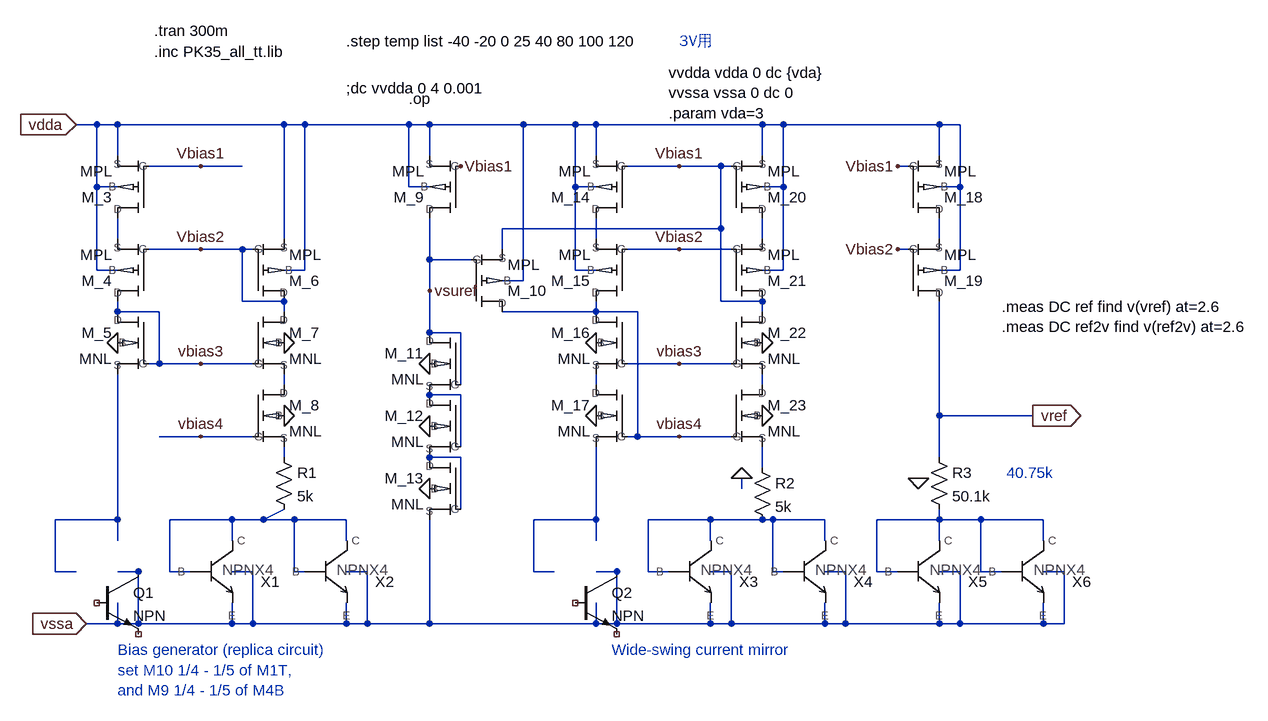
[diagram p0: schematic bgr.asc]
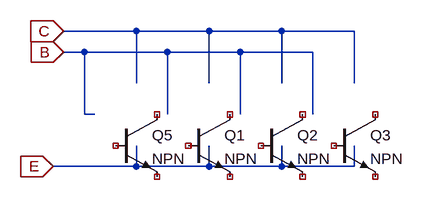
[diagram p1: sub-circuit npn4.asc]
bgr.asc, the LTspice schematic file:
Version 4
SHEET 1 4860 5172
WIRE 800 -592 768 -592
WIRE 832 -592 800 -592
WIRE 1088 -592 832 -592
WIRE 1120 -592 1088 -592
WIRE 1280 -592 1120 -592
WIRE 1312 -592 1280 -592
WIRE 1456 -592 1312 -592
WIRE 1536 -592 1456 -592
WIRE 1568 -592 1536 -592
WIRE 1824 -592 1568 -592
WIRE 1856 -592 1824 -592
WIRE 2096 -592 1856 -592
WIRE 2128 -592 2096 -592
WIRE 832 -544 832 -592
WIRE 1312 -544 1312 -592
WIRE 1568 -544 1568 -592
WIRE 1824 -544 1824 -592
WIRE 2096 -544 2096 -592
WIRE 960 -528 880 -528
WIRE 1024 -528 960 -528
WIRE 1696 -528 1616 -528
WIRE 1760 -528 1696 -528
WIRE 1776 -528 1760 -528
WIRE 2048 -528 2032 -528
WIRE 800 -496 800 -592
WIRE 832 -496 800 -496
WIRE 1280 -496 1280 -592
WIRE 1312 -496 1280 -496
WIRE 1536 -496 1536 -592
WIRE 1568 -496 1536 -496
WIRE 1856 -496 1856 -592
WIRE 1856 -496 1824 -496
WIRE 2128 -496 2128 -592
WIRE 2128 -496 2096 -496
WIRE 1760 -432 1760 -528
WIRE 1760 -432 1424 -432
WIRE 832 -416 832 -448
WIRE 1088 -416 1088 -592
WIRE 1568 -416 1568 -448
WIRE 1824 -416 1824 -448
WIRE 2096 -416 2096 -448
WIRE 960 -400 880 -400
WIRE 1024 -400 960 -400
WIRE 1040 -400 1024 -400
WIRE 1424 -400 1424 -432
WIRE 1696 -400 1616 -400
WIRE 1776 -400 1696 -400
WIRE 2048 -400 2032 -400
WIRE 1312 -384 1312 -448
WIRE 1376 -384 1312 -384
WIRE 800 -368 800 -496
WIRE 832 -368 800 -368
WIRE 1120 -368 1120 -592
WIRE 1120 -368 1088 -368
WIRE 1536 -368 1536 -496
WIRE 1568 -368 1536 -368
WIRE 1856 -368 1856 -496
WIRE 1856 -368 1824 -368
WIRE 2128 -368 2128 -496
WIRE 2128 -368 2096 -368
WIRE 1456 -352 1456 -592
WIRE 1456 -352 1424 -352
WIRE 1312 -336 1312 -384
WIRE 1024 -320 1024 -400
WIRE 1088 -320 1024 -320
WIRE 1760 -320 1760 -432
WIRE 1824 -320 1824 -336
WIRE 1824 -320 1760 -320
WIRE 832 -304 832 -320
WIRE 896 -304 832 -304
WIRE 1088 -304 1088 -320
WIRE 1568 -304 1568 -320
WIRE 1568 -304 1424 -304
WIRE 1632 -304 1568 -304
WIRE 1824 -304 1824 -320
WIRE 1312 -272 1312 -336
WIRE 1360 -272 1312 -272
WIRE 896 -224 896 -304
WIRE 896 -224 880 -224
WIRE 960 -224 896 -224
WIRE 1040 -224 960 -224
WIRE 1696 -224 1616 -224
WIRE 1776 -224 1696 -224
WIRE 1088 -192 1088 -208
WIRE 1360 -192 1360 -272
WIRE 1568 -192 1568 -208
WIRE 1824 -192 1824 -208
WIRE 1360 -176 1312 -176
WIRE 2096 -144 2096 -320
WIRE 2240 -144 2096 -144
WIRE 960 -112 896 -112
WIRE 1040 -112 960 -112
WIRE 1632 -112 1632 -304
WIRE 1632 -112 1616 -112
WIRE 1696 -112 1632 -112
WIRE 1776 -112 1696 -112
WIRE 1360 -96 1360 -176
WIRE 1088 -80 1088 -96
WIRE 1360 -80 1312 -80
WIRE 2096 -80 2096 -144
WIRE 1824 -64 1824 -96
WIRE 1792 -32 1792 -48
WIRE 1360 0 1360 -80
WIRE 832 16 832 -208
WIRE 832 16 736 16
WIRE 1008 16 912 16
WIRE 1056 16 1088 0
WIRE 1056 16 1008 16
WIRE 1104 16 1056 16
WIRE 1184 16 1104 16
WIRE 1568 16 1568 -96
WIRE 1568 16 1472 16
WIRE 1744 16 1648 16
WIRE 1824 16 1744 16
WIRE 1840 16 1824 16
WIRE 1920 16 1840 16
WIRE 2096 16 2096 0
WIRE 2096 16 2000 16
WIRE 2160 16 2096 16
WIRE 2256 16 2160 16
WIRE 832 48 832 16
WIRE 1008 48 1008 16
WIRE 1184 48 1184 16
WIRE 1568 48 1568 16
WIRE 1744 48 1744 16
WIRE 1920 48 1920 16
WIRE 2096 48 2096 16
WIRE 2256 48 2256 16
WIRE 736 96 736 16
WIRE 768 96 736 96
WIRE 864 96 832 96
WIRE 912 96 912 16
WIRE 944 96 912 96
WIRE 1040 96 1008 96
WIRE 1104 96 1104 16
WIRE 1120 96 1104 96
WIRE 1216 96 1184 96
WIRE 1472 96 1472 16
WIRE 1504 96 1472 96
WIRE 1600 96 1568 96
WIRE 1648 96 1648 16
WIRE 1680 96 1648 96
WIRE 1776 96 1744 96
WIRE 1840 96 1840 16
WIRE 1856 96 1840 96
WIRE 1952 96 1920 96
WIRE 2000 96 2000 16
WIRE 2032 96 2000 96
WIRE 2128 96 2096 96
WIRE 2160 96 2160 16
WIRE 2192 96 2160 96
WIRE 2288 96 2256 96
WIRE 832 176 832 144
WIRE 832 176 784 176
WIRE 864 176 864 96
WIRE 864 176 832 176
WIRE 1008 176 1008 144
WIRE 1008 176 864 176
WIRE 1040 176 1040 96
WIRE 1040 176 1008 176
WIRE 1184 176 1184 144
WIRE 1184 176 1040 176
WIRE 1216 176 1216 96
WIRE 1216 176 1184 176
WIRE 1312 176 1312 16
WIRE 1312 176 1216 176
WIRE 1568 176 1568 144
WIRE 1568 176 1312 176
WIRE 1600 176 1600 96
WIRE 1600 176 1568 176
WIRE 1744 176 1744 144
WIRE 1744 176 1600 176
WIRE 1776 176 1776 96
WIRE 1776 176 1744 176
WIRE 1920 176 1920 144
WIRE 1920 176 1776 176
WIRE 1952 176 1952 96
WIRE 1952 176 1920 176
WIRE 2096 176 2096 144
WIRE 2096 176 1952 176
WIRE 2128 176 2128 96
WIRE 2128 176 2096 176
WIRE 2256 176 2256 144
WIRE 2256 176 2128 176
WIRE 2288 176 2288 96
WIRE 2288 176 2256 176
FLAG 1312 -336 vsuref
FLAG 1696 -528 Vbias1
FLAG 1360 -528 Vbias1
FLAG 1696 -400 Vbias2
FLAG 2032 -528 Vbias1
FLAG 2032 -400 Vbias2
FLAG 768 -592 vdda
IOPIN 768 -592 In
FLAG 784 176 vssa
IOPIN 784 176 In
FLAG 2240 -144 vref
IOPIN 2240 -144 Out
FLAG 960 -528 Vbias1
FLAG 960 -400 Vbias2
FLAG 1696 -224 vbias3
FLAG 1696 -112 vbias4
FLAG 960 -112 vbias4
FLAG 960 -224 vbias3
FLAG 1792 -48 0
FLAG 2064 -48 0
FLAG 832 -256 0
FLAG 1088 -256 0
FLAG 1088 -144 0
FLAG 1312 -224 0
FLAG 1312 -128 0
FLAG 1312 -32 0
FLAG 1568 -256 0
FLAG 1568 -144 0
FLAG 1824 -256 0
FLAG 1824 -144 0
SYMBOL NPN4 976 96 R0
SYMATTR InstName X1
SYMBOL NPN4 1152 96 R0
SYMATTR InstName X2
SYMBOL NPN4 1712 96 R0
SYMATTR InstName X3
SYMBOL NPN4 1888 96 R0
SYMATTR InstName X4
SYMBOL NPN4 2064 96 R0
SYMATTR InstName X5
SYMBOL NPN4 2224 96 R0
SYMATTR InstName X6
SYMBOL npn 800 96 R0
SYMATTR InstName Q1
SYMBOL npn 1536 96 R0
SYMATTR InstName Q2
SYMBOL MPL 848 -496 R180
SYMATTR InstName M_3
SYMATTR SpiceLine l=5u w=30u pd=w+l+l ps=pd ad=w*l as=ad m=6
SYMBOL MPL 848 -368 R180
SYMATTR InstName M_4
SYMATTR SpiceLine l=5u w=30u pd=w+l+l ps=pd ad=w*l as=ad m=6
SYMBOL MNL 848 -256 M0
SYMATTR InstName M_5
SYMATTR SpiceLine l=10u w=4u pd=w+l+l ps=pd ad=w*l as=ad m=6
SYMBOL MPL 1072 -368 M180
SYMATTR InstName M_6
SYMATTR SpiceLine l=5u w=6u pd=w+l+l ps=pd ad=w*l as=ad m=6
SYMBOL MNL 1072 -256 R0
SYMATTR InstName M_7
SYMATTR SpiceLine l=10u w=20u pd=w+l+l ps=pd ad=w*l as=ad m=6
SYMBOL MNL 1072 -144 R0
SYMATTR InstName M_8
SYMATTR SpiceLine l=10u w=20u pd=w+l+l ps=pd ad=w*l as=ad m=6
SYMBOL res 1072 -96 R0
SYMATTR InstName R1
SYMATTR Value 5k
SYMBOL res 1808 -80 R0
SYMATTR InstName R2
SYMATTR Value 5k
SYMBOL res 2080 -96 R0
SYMATTR InstName R3
SYMATTR Value 50.1k
SYMBOL MPL 1328 -496 R180
SYMATTR InstName M_9
SYMATTR SpiceLine l=2u w=30u pd=w+l+l ps=pd ad=w*l as=ad m=1
SYMBOL MPL 1408 -352 M180
SYMATTR InstName M_10
SYMATTR SpiceLine l=1u w=10u pd=w+l+l ps=pd ad=w*l as=ad m=1
SYMBOL MNL 1328 -224 M0
SYMATTR InstName M_11
SYMATTR SpiceLine l=10u w=10u pd=w+l+l ps=pd ad=w*l as=ad m=1
SYMBOL MNL 1328 -128 M0
SYMATTR InstName M_12
SYMATTR SpiceLine l=10u w=10u pd=w+l+l ps=pd ad=w*l as=ad m=1
SYMBOL MNL 1328 -32 M0
SYMATTR InstName M_13
SYMATTR SpiceLine l=10u w=10u pd=w+l+l ps=pd ad=w*l as=ad m=1
SYMBOL MPL 1584 -496 R180
SYMATTR InstName M_14
SYMATTR SpiceLine l=5u w=30u pd=w+l+l ps=pd ad=w*l as=ad m=6
SYMBOL MPL 1584 -368 R180
SYMATTR InstName M_15
SYMATTR SpiceLine l=5u w=30u pd=w+l+l ps=pd ad=w*l as=ad m=6
SYMBOL MNL 1584 -256 M0
SYMATTR InstName M_16
SYMATTR SpiceLine l=10u w=20u pd=w+l+l ps=pd ad=w*l as=ad m=6
SYMBOL MNL 1584 -144 M0
SYMATTR InstName M_17
SYMATTR SpiceLine l=10u w=20u pd=w+l+l ps=pd ad=w*l as=ad m=6
SYMBOL MPL 2080 -496 M180
SYMATTR InstName M_18
SYMATTR SpiceLine l=5u w=30u pd=w+l+l ps=pd ad=w*l as=ad m=6
SYMBOL MPL 2080 -368 M180
SYMATTR InstName M_19
SYMATTR SpiceLine l=5u w=30u pd=w+l+l ps=pd ad=w*l as=ad m=6
SYMBOL MPL 1808 -496 M180
SYMATTR InstName M_20
SYMATTR SpiceLine l=5u w=30u pd=w+l+l ps=pd ad=w*l as=ad m=6
SYMBOL MPL 1808 -368 M180
SYMATTR InstName M_21
SYMATTR SpiceLine l=5u w=30u pd=w+l+l ps=pd ad=w*l as=ad m=6
SYMBOL MNL 1808 -256 R0
SYMATTR InstName M_22
SYMATTR SpiceLine l=10u w=20u pd=w+l+l ps=pd ad=w*l as=ad m=6
SYMBOL MNL 1808 -144 R0
SYMATTR InstName M_23
SYMATTR SpiceLine l=10u w=20u pd=w+l+l ps=pd ad=w*l as=ad m=6
TEXT 1680 -672 Left 2 !vvdda vdda 0 dc {vda}\nvvssa vssa 0 dc 0\n.param vda=3
TEXT 1184 -648 Left 2 !;dc vvdda 0 4 0.001
TEXT 1184 -720 Left 2 !.step temp list -40 -20 0 25 40 80 100 120
TEXT 832 216 Left 2 ;Bias generator (replica circuit)\nset M10 1/4 - 1/5 of M1T, \nand M9 1/4 - 1/5 of M4B
TEXT 1592 216 Left 2 ;Wide-swing current mirror
TEXT 1280 -632 Left 2 !.op
TEXT 2192 -312 Left 2 !.meas DC ref find v(vref) at=2.6\n.meas DC ref2v find v(ref2v) at=2.6
TEXT 888 -704 Left 2 !.inc PK35_all_tt.lib
TEXT 888 -736 Left 2 !.tran 300m
TEXT 2200 -56 Left 2 ;40.75k
TEXT 1696 -720 Left 2 ;3V用

npn4.asc, the sub-circuit schematic file:
Version 4
SHEET 1 880 1556
WIRE -800 16 -912 16
WIRE -688 16 -800 16
WIRE -576 16 -688 16
WIRE -464 16 -576 16
WIRE -880 48 -912 48
WIRE -752 48 -880 48
WIRE -640 48 -752 48
WIRE -528 48 -640 48
WIRE -800 96 -800 16
WIRE -688 96 -688 16
WIRE -576 96 -576 16
WIRE -464 96 -464 16
WIRE -880 144 -880 48
WIRE -864 144 -880 144
WIRE -752 144 -752 48
WIRE -640 144 -640 48
WIRE -528 144 -528 48
WIRE -800 224 -800 192
WIRE -800 224 -928 224
WIRE -688 224 -688 192
WIRE -688 224 -800 224
WIRE -576 224 -576 192
WIRE -576 224 -688 224
WIRE -464 224 -464 192
WIRE -464 224 -576 224
FLAG -912 16 C
IOPIN -912 16 In
FLAG -928 224 E
IOPIN -928 224 In
FLAG -912 48 B
IOPIN -912 48 In
SYMBOL NPN -832 144 R0
SYMATTR InstName Q5
SYMBOL NPN -720 144 R0
SYMATTR InstName Q1
SYMBOL NPN -608 144 R0
SYMATTR InstName Q2
SYMBOL NPN -496 144 R0
SYMATTR InstName Q3

The netlist it stands for:
* bgr.asc
XX1 N013 vssa N013 npn4
XX2 N013 vssa N013 npn4
XX3 N015 vssa N015 npn4
XX4 N015 vssa N015 npn4
XX5 N016 vssa N016 npn4
XX6 N016 vssa N016 npn4
* Q1: NPN (symbol npn not certain, pin order unknown); nets seen at it: 0, vssa
* Q2: NPN (symbol npn not certain, pin order unknown); nets seen at it: 0, vssa
XM_3 N001 Vbias1 vdda vdda MPL l=5u w=30u pd=w+l+l ps=pd ad=w*l as=ad m=6  ; pins D G S B
XM_4 vbias3 Vbias2 N001 vdda MPL l=5u w=30u pd=w+l+l ps=pd ad=w*l as=ad m=6  ; pins D G S B
XM_5 vbias3 vbias3 N012 0 MNL l=10u w=4u pd=w+l+l ps=pd ad=w*l as=ad m=6  ; pins D G S B
XM_6 Vbias2 Vbias2 vdda vdda MPL l=5u w=6u pd=w+l+l ps=pd ad=w*l as=ad m=6  ; pins D G S B
XM_7 Vbias2 vbias3 N005 0 MNL l=10u w=20u pd=w+l+l ps=pd ad=w*l as=ad m=6  ; pins D G S B
XM_8 N005 vbias4 N009 0 MNL l=10u w=20u pd=w+l+l ps=pd ad=w*l as=ad m=6  ; pins D G S B
R1 N009 N013 5k
R2 N011 N015 5k
R3 vref N016 50.1k
XM_9 vsuref Vbias1 vdda vdda MPL l=2u w=30u pd=w+l+l ps=pd ad=w*l as=ad m=1  ; pins D G S B
XM_10 vbias4 vsuref Vbias1 vdda MPL l=1u w=10u pd=w+l+l ps=pd ad=w*l as=ad m=1  ; pins D G S B
XM_11 vsuref vsuref N008 0 MNL l=10u w=10u pd=w+l+l ps=pd ad=w*l as=ad m=1  ; pins D G S B
XM_12 N008 N008 N010 0 MNL l=10u w=10u pd=w+l+l ps=pd ad=w*l as=ad m=1  ; pins D G S B
XM_13 N010 N010 vssa 0 MNL l=10u w=10u pd=w+l+l ps=pd ad=w*l as=ad m=1  ; pins D G S B
XM_14 N002 Vbias1 vdda vdda MPL l=5u w=30u pd=w+l+l ps=pd ad=w*l as=ad m=6  ; pins D G S B
XM_15 vbias4 Vbias2 N002 vdda MPL l=5u w=30u pd=w+l+l ps=pd ad=w*l as=ad m=6  ; pins D G S B
XM_16 vbias4 vbias3 N006 0 MNL l=10u w=20u pd=w+l+l ps=pd ad=w*l as=ad m=6  ; pins D G S B
XM_17 N006 vbias4 N014 0 MNL l=10u w=20u pd=w+l+l ps=pd ad=w*l as=ad m=6  ; pins D G S B
XM_18 N004 Vbias1 vdda vdda MPL l=5u w=30u pd=w+l+l ps=pd ad=w*l as=ad m=6  ; pins D G S B
XM_19 vref Vbias2 N004 vdda MPL l=5u w=30u pd=w+l+l ps=pd ad=w*l as=ad m=6  ; pins D G S B
XM_20 N003 Vbias1 vdda vdda MPL l=5u w=30u pd=w+l+l ps=pd ad=w*l as=ad m=6  ; pins D G S B
XM_21 Vbias1 Vbias2 N003 vdda MPL l=5u w=30u pd=w+l+l ps=pd ad=w*l as=ad m=6  ; pins D G S B
XM_22 Vbias1 vbias3 N007 0 MNL l=10u w=20u pd=w+l+l ps=pd ad=w*l as=ad m=6  ; pins D G S B
XM_23 N007 vbias4 N011 0 MNL l=10u w=20u pd=w+l+l ps=pd ad=w*l as=ad m=6  ; pins D G S B

* block symbol definitions
.subckt npn4 B E C
* Q5: NPN (symbol NPN not certain, pin order unknown); nets seen at it: 0
* Q1: NPN (symbol NPN not certain, pin order unknown); nets seen at it: 0
* Q2: NPN (symbol NPN not certain, pin order unknown); nets seen at it: 0
* Q3: NPN (symbol NPN not certain, pin order unknown); nets seen at it: 0
.ends npn4

vvdda vdda 0 dc {vda}
vvssa vssa 0 dc 0
.param vda=3
;dc vvdda 0 4 0.001
.step temp list -40 -20 0 25 40 80 100 120
* Bias generator (replica circuit)
* set M10 1/4 - 1/5 of M1T,
* and M9 1/4 - 1/5 of M4B
* Wide-swing current mirror
.op
.meas DC ref find v(vref) at=2.6
.meas DC ref2v find v(ref2v) at=2.6
.inc PK35_all_tt.lib
.tran 300m
* 40.75k
* 3V用
.backanno
.end